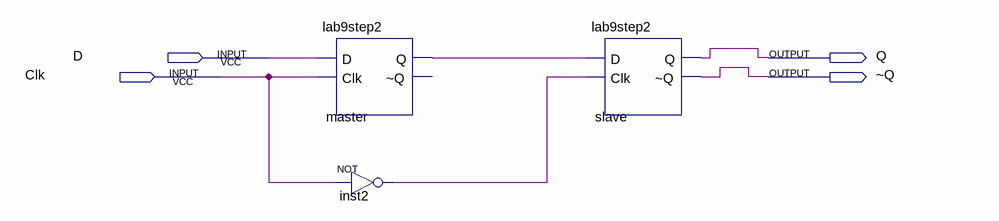
[diagram p0: schematic sheet]
// Quartus schematic lab9step3a.bdf as structural Verilog: 3 symbols, 4 pins
module lab9step3a (
  input  D,
  input  Clk,
  output Q,
  output \~Q 
);

  wire inst2_out, master_q;

  lab9step2 master (.D(D), .Clk(Clk), .Q(master_q));  // open: ~Q
  not inst2 (inst2_out, Clk);
  lab9step2 slave (.D(master_q), .Clk(inst2_out), .Q(Q), .\~Q (\~Q ));
endmodule
